# EAGLE schematic valve_driver_pwm_ctrl (EAGLE 6.6.0)
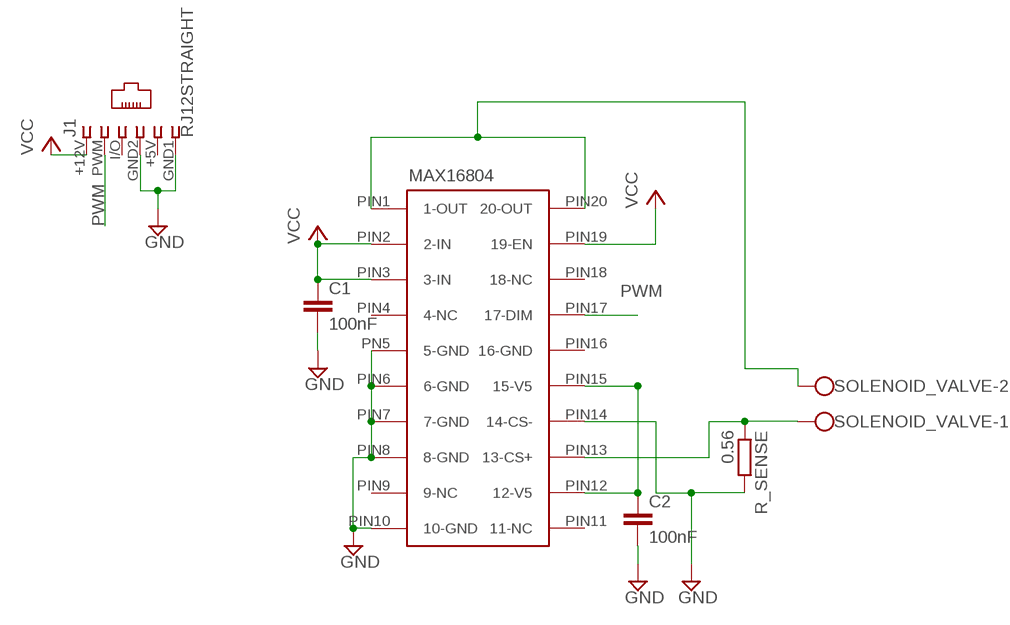
[diagram p0: schematic, sheet 1]

## Parts
C1  100nF  C-EUC1206  [C1206]
C2  100nF  C-EUC1206  [C1206]
J1  RJ12STRAIGHT  [RJ12-STRAIGHT]
R_SENSE  0.56  R-EU_M1206  [M1206]
SOLENOID_VALVE  W237-102  [W237-102]
U$1  MAX16804ATP+  [TQFN-20]

## Nets
GND: C1.2 C2.2 J1.GND1 J1.GND2 R_SENSE.2 U$1.PIN6(6-GND) U$1.PIN7(7-GND) U$1.PIN8(8-GND) U$1.PIN10(10-GND) U$1.PIN14(14-CS-) U$1.PN5(5-GND)
N$3: SOLENOID_VALVE.2 U$1.PIN1(1-OUT) U$1.PIN20(20-OUT)
N$4: C2.1 U$1.PIN12(12-V5) U$1.PIN15(15-V5)
N$7: R_SENSE.1 SOLENOID_VALVE.1 U$1.PIN13(13-CS+)
PWM: J1.PWM U$1.PIN17(17-DIM)
VCC: C1.1 J1.+12V U$1.PIN2(2-IN) U$1.PIN3(3-IN) U$1.PIN19(19-EN)
Unconnected: J1.+5V J1.I/O U$1.PIN4(4-NC) U$1.PIN9(9-NC) U$1.PIN11(11-NC) U$1.PIN16(16-GND) U$1.PIN18(18-NC)

## Library data of the parts
C1 C2 = rcl:C-EU: CAPACITOR, European symbol
J1 = lpatiny:RJ12: CORCOM Modular RJ Jacks No Shield Source: www.tycoelectronics.com .. ENG_DS_1654001_1099_RJ_L_0507.pdf
R_SENSE = rcl:R-EU_: RESISTOR, European symbol
SOLENOID_VALVE = con-wago-500:W237-102: WAGO SCREW CLAMP; MPN: 237-102; OC_FARNELL: unknown; OC_NEWARK: 70K9898
U$1 = driver:MAX16804ATP+: High-Voltage, 350mA LED Driver with Analog and PWM Dimming Control